# EAGLE design GammaSpectrometer (EAGLE 6.3)
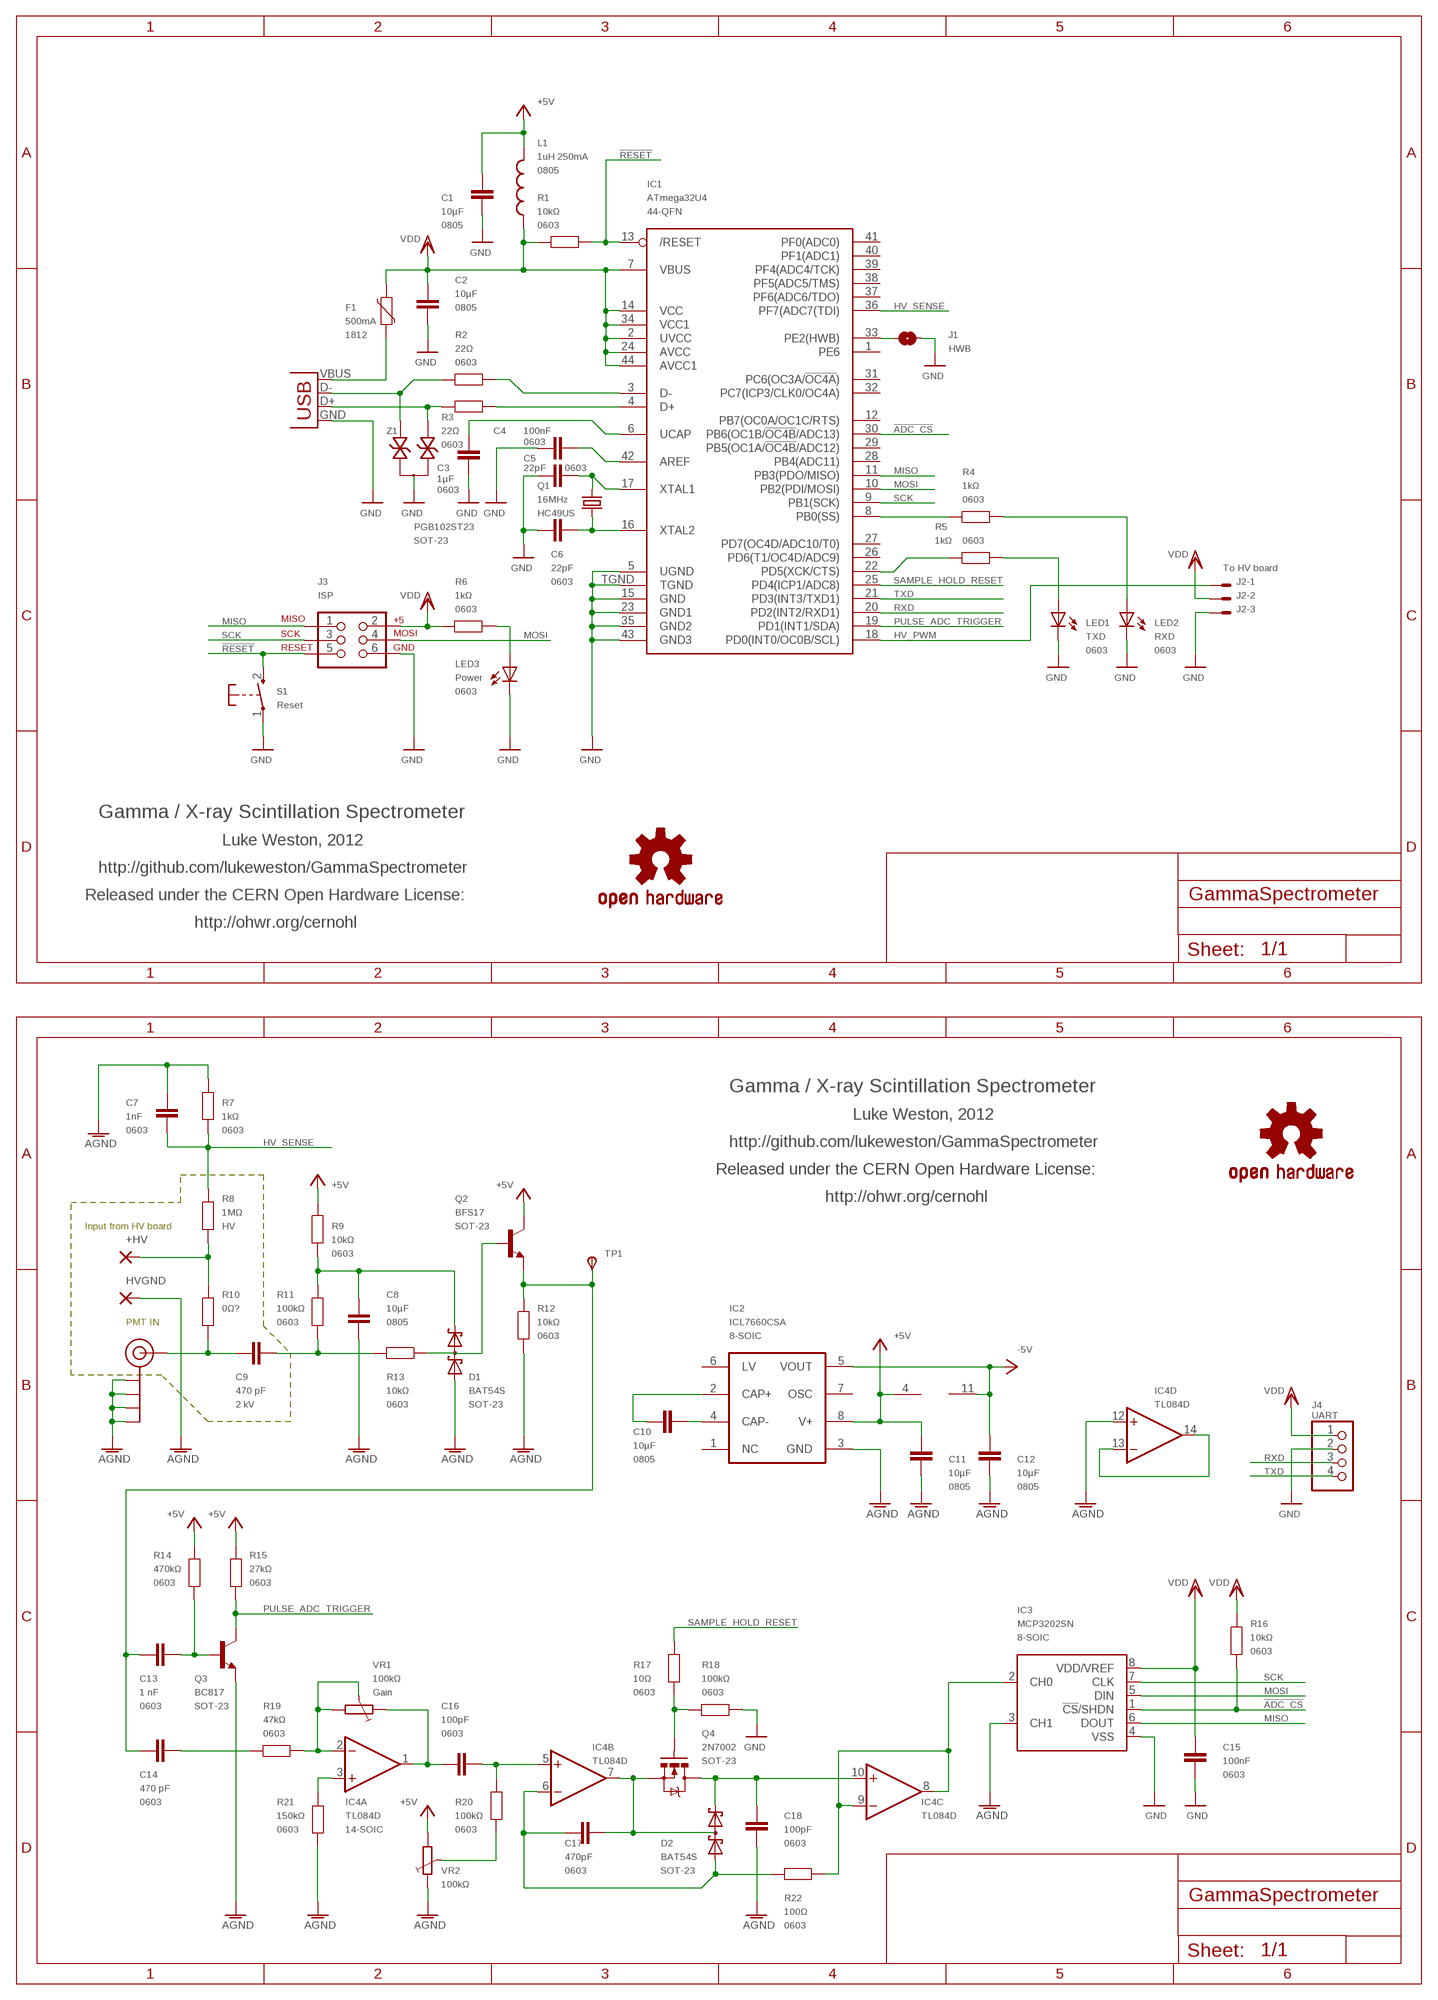
[diagram p0: schematic, sheet 1]

## Parts
C1  10µF  CAP0805  [0805]
C2  10µF  CAP0805  [0805]
C3  1µF  CAP0603  [0603]
C4  100nF  CAP0603  [0603]
C5  22pF  CAP0603  [0603]
C6  22pF  CAP0603  [0603]
C7  1nF  CAP0603  [0603]
C8  10µF  CAP0805  [0805]
C9  470 pF  CAP0603  [0603]
C10  10µF  CAP0805  [0805]
C11  10µF  CAP0805  [0805]
C12  10µF  CAP0805  [0805]
C13  1 nF  CAP0603  [0603]
C14  470 pF  CAP0603  [0603]
C15  100nF  CAP0603  [0603]
C16  100pF  CAP0603  [0603]
C17  470pF  CAP0603  [0603]
C18  100pF  CAP0603  [0603]
D1  BAT54S  [SOT23]
D2  BAT54S  [SOT23]
F1  500mA  PTC  [1812]
IC1  ATmega32U4  ATMEGA32U4-QFN  [QFN-44N]
IC2  ICL7660CSA  [SO08]
IC3  MCP3202SN  [SO-08]
IC4  TL084D  [SO14]
J1  HWB  SJ  [SJ]
J2  To HV board  22-23-2031  [22-23-2031]
J3  ISP  AVR_SPI_PRG_6NS  [2X3-NS]
J4  UART  PINHD-1X4  [1X04]
J$1  PMT  SMA_EDGE  [SMA-EDGE]
L1  1uH 250mA  L-USL2012C  [L2012C]
LED1  TXD  LED0603  [LED-0603]
LED2  RXD  LED0603  [LED-0603]
LED3  Power  LED0603  [LED-0603]
PAD1  +HV  2,54/0,9  [2,54/0,9]
PAD2  HVGND  2,54/0,9  [2,54/0,9]
Q1  16MHz  CRYSTALHC49US  [HC49US]
Q2  BFS17  BFS17-NPN-SOT23-BEC  [SOT23-BEC]
Q3  BC817  BC817-NPN-SOT23-BEC  [SOT23-BEC]
Q4  2N7002  MOSFET-NCHANNELSMD  [SOT23-3]
R1  10kΩ  RESISTOR0603  [0603]
R2  22Ω  RESISTOR0603  [0603]
R3  22Ω  RESISTOR0603  [0603]
R4  1kΩ  RESISTOR0603  [0603]
R5  1kΩ  RESISTOR0603  [0603]
R6  1kΩ  RESISTOR0603  [0603]
R7  1kΩ  RESISTOR0603  [0603]
R8  1MΩ  RESISTOR0603  [0603]
R9  10kΩ  RESISTOR0603  [0603]
R10  0Ω?  RESISTOR0603  [0603]
R11  100kΩ  RESISTOR0603  [0603]
R12  10kΩ  RESISTOR0603  [0603]
R13  10kΩ  RESISTOR0603  [0603]
R14  470kΩ  RESISTOR0603  [0603]
R15  27kΩ  RESISTOR0603  [0603]
R16  10kΩ  RESISTOR0603  [0603]
R17  10Ω  RESISTOR0603  [0603]
R18  100kΩ  RESISTOR0603  [0603]
R19  47kΩ  RESISTOR0603  [0603]
R20  100kΩ  RESISTOR0603  [0603]
R21  150kΩ  RESISTOR0603  [0603]
R22  100Ω  RESISTOR0603  [0603]
S1  Reset  TAC_SWITCH_2PIN  [TACTILE_SWITCH_SMD_2PIN_TINY]
SY  OSHW-LOGOS  [OSHW-LOGO-S]
SY1  OSHW-LOGOS  [OSHW-LOGO-S]
TP1  TPSPAD1-13  [P1-13]
VR1  100kΩ  TRIM_EU-CT6  [CT6]
VR2  100kΩ  TRIM_EU-CT6  [CT6]
X1  USB-MICROB  [USB-MICROB]
Z1  PGB102ST23  [SOT23-3]

## Nets
!ADC_CS: IC1.30(PB6(OC1B/!OC4B!/ADC13)) IC3.1(!CS!/SHDN) R16.1
!RESET: IC1.13(/RESET) J3.5 R1.1 S1.2(S)
+5V: C1.1 C11.1 IC2.8(V+) IC4.4(P:V+) L1.2 Q2.C R9.2 R14.1 R15.1 VR2.A
-5V: C12.1 IC2.5(VOUT) IC4.11(P:V-)
AGND: C7.2 C8.2 C11.2 C12.2 C18.2 D1.1(A1) IC2.3(GND) IC3.3(CH1) IC4.12(D:+IN) J$1.GND@0(GND) J$1.GND@1(GND) J$1.GND@2(GND) J$1.GND@3(GND) PAD2.1(P) Q3.E R7.2 R12.1 R21.2 VR2.E
GND: C1.2 C2.2 C3.1 C4.1 C5.1 C6.1 C15.1 IC1.5(UGND) IC1.15(GND) IC1.23(GND1) IC1.35(GND2) IC1.43(GND3) IC1.TGND IC3.4(VSS) J1.1 J2.3 J3.6 J4.2 LED1.C LED2.C LED3.C R18.2 S1.1(P) X1.GND Z1.3
HV_PWM: IC1.18(PD0(INT0/OC0B/SCL)) J2.1
HV_SENSE: C7.1 IC1.36(PF7(ADC7(TDI)) R7.1 R8.2
HWB: IC1.33(PE2(HWB)) J1.2
MISO: IC1.11(PB3(PDO/MISO)) IC3.6(DOUT) J3.1
MOSI: IC1.10(PB2(PDI/MOSI)) IC3.5(DIN) J3.4
N$1: PAD1.1(P) R8.1 R10.2
N$2: C9.1 J$1.SIG(SIGNAL) R10.1
N$3: C8.1 D1.3(C2) R9.1 R11.2
N$4: C9.2 R11.1 R13.2
N$5: C18.1 D2.3(C2) IC4.10(C:+IN) Q4.3(D)
N$6: IC4.2(A:-IN) R19.2 VR1.A VR1.S
N$7: C13.2 C14.2 Q2.E R12.2 TP1.TP(PP)
N$8: C14.1 R19.1
N$9: C17.1 D2.2(C1A2) IC4.7(B:OUT) Q4.2(S)
N$10: IC4.3(A:+IN) R21.1
N$11: C16.2 IC4.1(A:OUT) VR1.E
N$12: D1.2(C1A2) Q2.B R13.1
N$13: C13.1 Q3.B R14.2
N$14: R20.2 VR2.S
N$15: C16.1 IC4.5(B:+IN) R20.1
N$16: C17.2 D2.1(A1) IC4.6(B:-IN) R22.2
N$17: C10.2 IC2.2(CAP+)
N$18: C10.1 IC2.4(CAP-)
N$19: Q4.1(G) R17.1 R18.1
N$20: F1.1 X1.VBUS
N$21: LED3.A R6.2
N$22: C4.2 IC1.42(AREF)
N$23: LED1.A R5.2
N$24: LED2.A R4.2
N$26: IC4.13(D:-IN) IC4.14(D:OUT)
N$28: C3.2 IC1.6(UCAP)
N$33: R3.2 X1.D+ Z1.1
N$34: R2.2 X1.D- Z1.2
N$35: C5.2 IC1.17(XTAL1) Q1.2
N$36: C6.2 IC1.16(XTAL2) Q1.1
N$37: IC1.4(D+) R3.1
N$38: IC1.3(D-) R2.1
PULSE: IC3.2(CH0) IC4.8(C:OUT) IC4.9(C:-IN) R22.1
PULSE_ADC_TRIGGER: IC1.19(PD1(INT1/SDA)) Q3.C R15.2
RXD: IC1.20(PD2(INT2/RXD1)) J4.3
RXLED: IC1.8(PB0(SS)) R4.1
SAMPLE_HOLD_RESET: IC1.25(PD4(ICP1/ADC8)) R17.2
SCK: IC1.9(PB1(SCK)) IC3.7(CLK) J3.3
TXD: IC1.21(PD3(INT3/TXD1)) J4.4
TXLED: IC1.22(PD5(XCK/CTS)) R5.1
VDD: C2.1 C15.2 F1.2 IC1.2(UVCC) IC1.7(VBUS) IC1.14(VCC) IC1.24(AVCC) IC1.34(VCC1) IC1.44(AVCC1) IC3.8(VDD/VREF) J2.2 J3.2 J4.1 L1.1 R1.2 R6.1 R16.2
Unconnected: IC1.1(PE6) IC1.12(PB7(OC0A/OC1C/RTS)) IC1.26(PD6(T1/OC4D/ADC9)) IC1.27(PD7(OC4D/ADC10/T0)) IC1.28(PB4(ADC11)) IC1.29(PB5(OC1A/!OC4B!/ADC12)) IC1.31(PC6(OC3A/!OC4A!)) IC1.32(PC7(ICP3/CLK0/OC4A)) IC1.37(PF6(ADC6/TDO)) IC1.38(PF5(ADC5/TMS)) IC1.39(PF4(ADC4/TCK)) IC1.40(PF1(ADC1)) IC1.41(PF0(ADC0)) IC2.1(NC) IC2.6(LV) IC2.7(OSC)

## Notes on the sheet
- Gamma / X-ray Scintillation Spectrometer
- Luke Weston, 2012
- http://github.com/lukeweston/GammaSpectrometer
- Released under the CERN Open Hardware License:
- http://ohwr.org/cernohl
- Gamma / X-ray Scintillation Spectrometer
- Luke Weston, 2012
- http://github.com/lukeweston/GammaSpectrometer
- Released under the CERN Open Hardware License:
- http://ohwr.org/cernohl
- Input from HV board
- PMT IN

## Library data of the parts
C1 C2 C8 C10-C12 = freetronics-master-v1:CAP: Capacitor Standard 0603 ceramic capacitor, and 0.1" leaded capacitor.; PACKAGE: 0805
C3-C7 C13-C18 = freetronics-master-v1:CAP: Capacitor Standard 0603 ceramic capacitor, and 0.1" leaded capacitor.; PACKAGE: 0603
C9 = freetronics-master-v1:CAP: Capacitor Standard 0603 ceramic capacitor, and 0.1" leaded capacitor.; VOLTAGE: 2 kV
D1 D2 = diode:BAT54S: Schottky Diodes Source: Fairchild .. BAT54.pdf; PACKAGE: SOT-23
F1 = freetronics-luke:PTC: Polymeric PTC ("Polyfuse"); PACKAGE: 1812
IC1 = freetronics-jon:ATMEGA32U4: ATMEGA32U4; PACKAGE: 44-QFN
IC2 = maxim:ICL7660CSA: VOLTAGE CONVERTER; MF: MAXIM; MPN: ICL7660CSA; OC_FARNELL: 9724710; OC_NEWARK: 34C3732; PACKAGE: 8-SOIC
IC3 = microchip-6:MCP3202: 2.7V Dual Channel 12-Bit A/D Converter with SPI Serial Interface Source: http://ww1.microchip.com/downloads/en/DeviceDoc/21034D.pdf; PACKAGE: 8-SOIC
IC4 = linear:TL084: OP AMP; PACKAGE: 14-SOIC
J1 = freetronics-luke:SJ: PCB "solder jumper". Note that there should nothing on the BOM corresponding to this "component".
J2 = con-molex:22-23-2031: .100" (2.54mm) Center Header - 3 Pin; MF: MOLEX; MPN: 22-23-2031; OC_FARNELL: 1462950; OC_NEWARK: 30C0862
J3 = SparkFun:AVR_SPI_PRG_6: AVR ISP 6 Pin This is the reduced ISP connector for AVR programming. Common on Arduino. This footprint will take up less PCB space and can be used with a 10-pin to 6-pin adapter such as SKU: BOB-08508
J4 = pinhead:PINHD-1X4: PIN HEADER
J$1 = SparkFun-Connectors:SMA_EDGE: SMA Antenna Connector End launch SMA connector. The paste layer has been removed so that the connector can be hand soldered onto the board after reflow.
L1 = rcl:L-US: INDUCTOR, American symbol; PACKAGE: 0805
LED1-LED3 = freetronics-master-v1:LED: LEDs Standard schematic elements and footprints for 5mm, 3mm, 1206, and 0603 sized LEDs. 5mm - Spark Fun Electronics SKU : COM-00529 (and others); PACKAGE: 0603
PAD1 PAD2 = wirepad:2,54/0,9: THROUGH-HOLE PAD
Q1 = freetronics-master-v1:CRYSTAL: Crystals Various standard crystals. Proven footprints. Spark Fun Electronics SKU : COM-00534; PACKAGE: HC49US
Q2 Q3 = transistor:*-NPN-: NPN Transistror BF959 corrected 2008.03.06; PACKAGE: SOT-23
Q4 = freetronics-master-v1:MOSFET-NCHANNEL; PACKAGE: SOT-23
R1-R7 R9 R11-R22 = freetronics-master-v1:RESISTOR: Resistor Basic schematic elements and footprints for 0603, 1206, and PTH 1/10th watt (small) resistors.; PACKAGE: 0603
R8 = freetronics-master-v1:RESISTOR: Resistor Basic schematic elements and footprints for 0603, 1206, and PTH 1/10th watt (small) resistors.; VOLTAGE: HV
R10 = freetronics-master-v1:RESISTOR: Resistor Basic schematic elements and footprints for 0603, 1206, and PTH 1/10th watt (small) resistors.
S1 = freetronics-master-v1:TAC_SWITCH_2PIN: Momentary Tactile Switch - 2 pin
SY SY1 = SparkFun:OSHW-LOGO: Open Source Hardware Logo This logo indicates the piece of hardware it is found on incorporates a OSHW license and/or adheres to the definition of open source hardware found here: http://freedomdefined.org/OSHW
TP1 = testpad:TPS: TEST PIN
VR1 = pot:TRIM_EU-: POTENTIOMETER; FUNCTION: Gain
VR2 = pot:TRIM_EU-: POTENTIOMETER
X1 = freetronics-master-v1:USB: USB Connectors USB-B-PTH is fully proven SKU : PRT-00139 USB-miniB is fully proven SKU : PRT-00587 USB-A-PCB is untested. USB-A-H is throughly reviewed, but untested. Spark Fun Electronics SKU : PRT-00437 USB-B-SMT is throughly reviewed, but untested. Needs silkscreen touching up. USB-A-S has not been used/tested USB-MB-H has not been used/tested
Z1 = freetronics-luke:PGB102ST23: Littelfuse PGB1 ESD transient suppressor in dual SOT-23 package. http://www.littelfuse.com/data/en/Data_Sheets/Littelfuse_PulseGuard-ESD_PGB1.pdf; PACKAGE: SOT-23

## Board
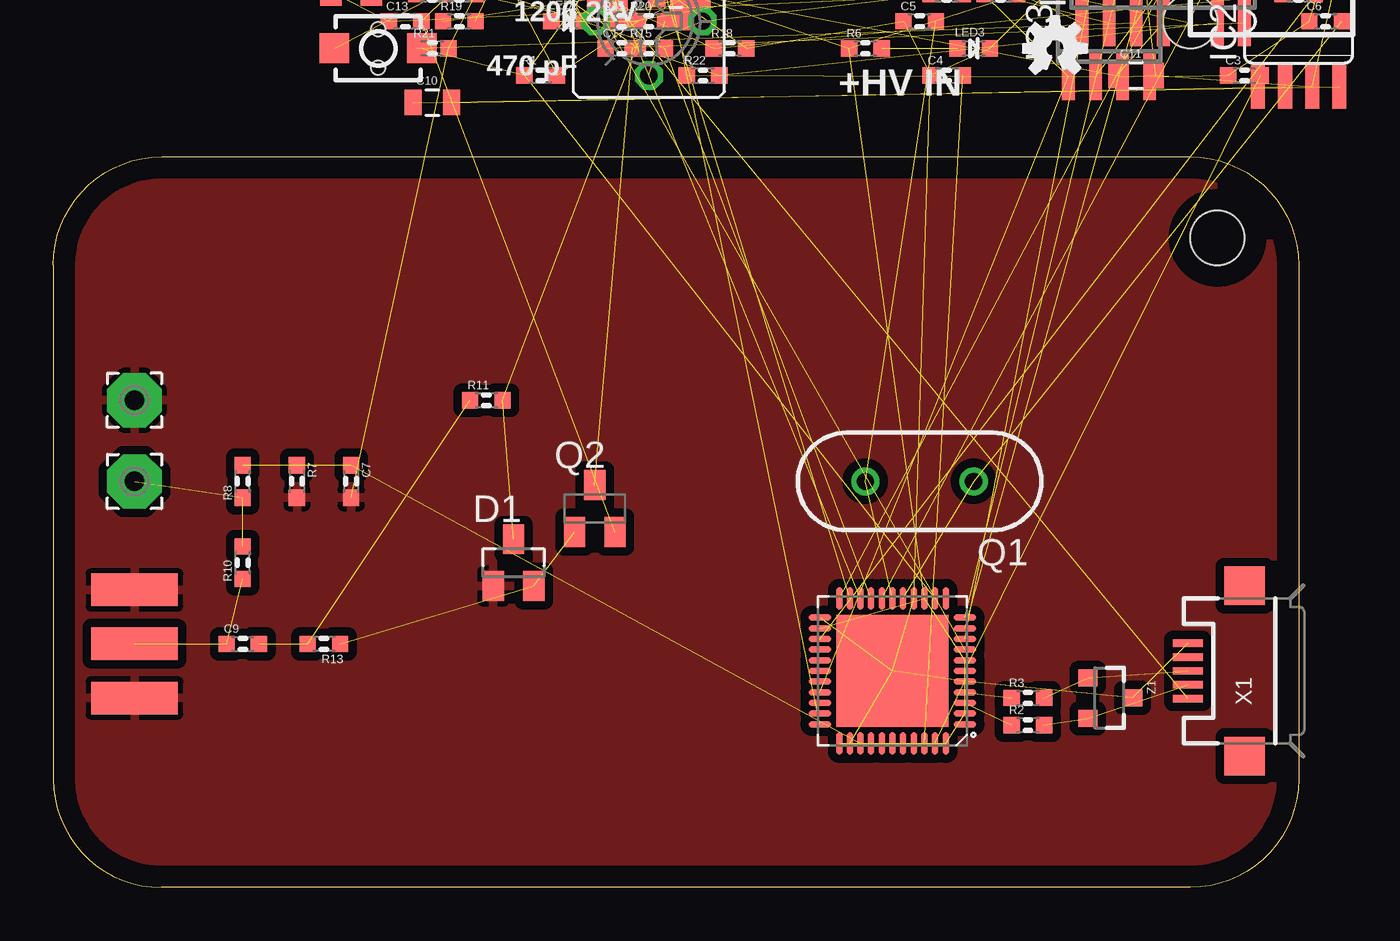
[diagram p1: board, top side]
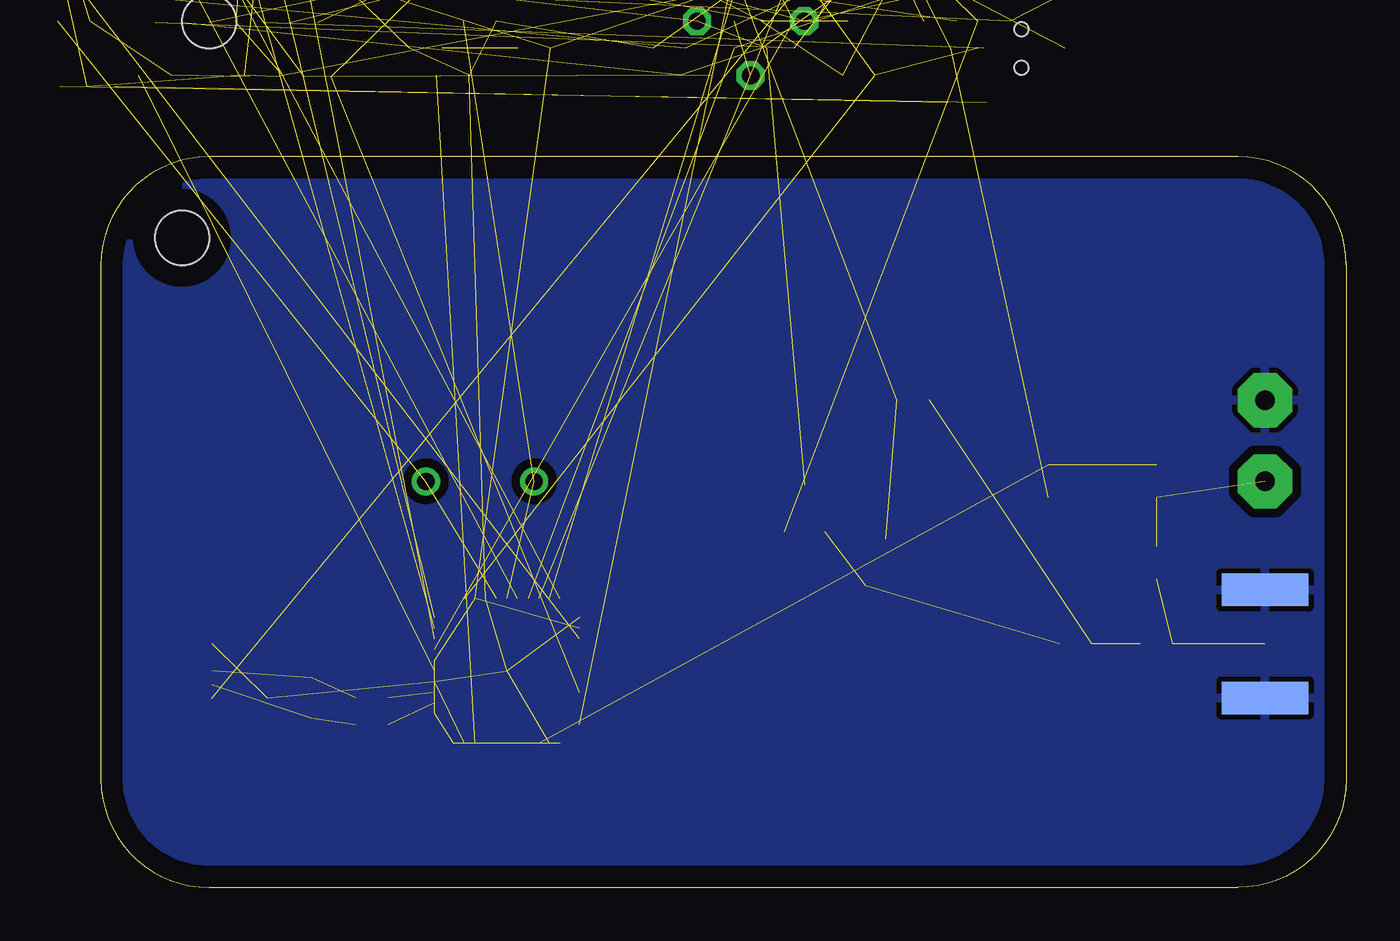
[diagram p2: board, bottom side, seen from below]

Size 58.42 x 34.29 mm. Coordinates in mm from the lower left corner, seen from the top.
Outline: 0,29.21 0,5.08 arc90 5.08,0 53.34,0 arc90 58.42,5.08 58.42,29.21 arc90 53.34,34.29 5.08,34.29 arc90 0,29.21
Copper layers (1*16): Top 0.035mm / dielectric 1.5mm / Bottom 0.035mm
Design rules "default": minimum track width 10mil, minimum drill 24mil, track to track 8mil, track to pad 8mil, pad to pad 8mil, via to via 8mil, smd to smd 8mil, copper to edge 40mil, drill to drill 8mil, minimum pad ring 10mil, minimum via ring 8mil, stop-mask expansion 4mil, vias tented up to drill 0mil, thermal gap 10mil
Holes 2.54 mm at 53.34,40.64 54.61,30.48

### Footprints (pad centres in the part's own frame; a part is rotated, then mirrored left to right if it is on the bottom)
0805 = smd 0.8 x 1.2: 1 -0.9,0; 2 0.9,0
0603 = smd 0.762 x 0.762: 1 -0.762,0; 2 0.762,0
SOT23 = smd 1 x 1.4: 1 -0.95,-1.1; 2 0.95,-1.1; 3 0,1.1
1812 = smd 1.9 x 3.4: 1 -1.95,0; 2 1.95,0
QFN-44N = smd 0.3 x 1.05: 1 -2.5,-3.4; 2 -2,-3.4; 3 -1.5,-3.4; 4 -1,-3.4; 5 -0.5,-3.4; 6 0,-3.4; 7 0.5,-3.4; 8 1,-3.4; 9 1.5,-3.4; 10 2,-3.4; 11 2.5,-3.4; 23 2.5,3.4; 24 2,3.4; 25 1.5,3.4; 26 1,3.4; 27 0.5,3.4; 28 0,3.4; 29 -0.5,3.4; 30 -1,3.4; 31 -1.5,3.4; 32 -2,3.4; 33 -2.5,3.4 | smd 1.05 x 0.3: 12 3.4,-2.5; 13 3.4,-2; 14 3.4,-1.5; 15 3.4,-1; 16 3.4,-0.5; 17 3.4,0; 18 3.4,0.5; 19 3.4,1; 20 3.4,1.5; 21 3.4,2; 22 3.4,2.5; 34 -3.4,2.5; 35 -3.4,2; 36 -3.4,1.5; 37 -3.4,1; 38 -3.4,0.5; 39 -3.4,0; 40 -3.4,-0.5; 41 -3.4,-1; 42 -3.4,-1.5; 43 -3.4,-2; 44 -3.4,-2.5 | smd 5.25 x 5.25: TGND 0,0
SO08 = smd 0.66 x 2.032: 1 -1.905,-3.073; 2 -0.635,-3.073; 3 0.635,-3.073; 4 1.905,-3.073; 5 1.905,3.073; 6 0.635,3.073; 7 -0.635,3.073; 8 -1.905,3.073
SO-08 = smd 0.6 x 2.2: 1 -1.905,-2.6; 2 -0.635,-2.6; 3 0.635,-2.6; 4 1.905,-2.6; 5 1.905,2.6; 6 0.635,2.6; 7 -0.635,2.6; 8 -1.905,2.6
SO14 = smd 0.6 x 2.2: 1 -3.81,-2.6; 2 -2.54,-2.6; 3 -1.27,-2.6; 4 0,-2.6; 5 1.27,-2.6; 6 2.54,-2.6; 7 3.81,-2.6; 8 3.81,2.6; 9 2.54,2.6; 10 1.27,2.6; 11 0,2.6; 12 -1.27,2.6; 13 -2.54,2.6; 14 -3.81,2.6
SJ = smd 1.168 x 1.6: 1 -0.762,0; 2 0.762,0
22-23-2031 = drill 1 long: 1 -2.54,0; 2 0,0; 3 2.54,0
2X3-NS = drill 1.016 pad 1.88 square: 1 -2.54,-1.27 | drill 1.016 pad 1.88 octagon: 2 -2.54,1.27; 3 0,-1.27; 4 0,1.27; 5 2.54,-1.27; 6 2.54,1.27
1X04 = drill 0.9 pad 1.93: 1 -3.81,0; 2 -1.27,0; 3 1.27,0; 4 3.81,0
SMA-EDGE = smd 1.524 x 4.064: GND@0 0,0; GND@1 5.08,0; SIG 2.54,0 | smd 1.524 x 4.064 bottom: GND@2 0,0; GND@3 5.08,0
L2012C = smd 1 x 1: 1 -1,0; 2 1,0
LED-0603 = smd 0.762 x 0.762: A -0.762,0; C 0.762,0
2,54/0,9 = drill 0.914 pad 2.54 octagon: 1 0,0
HC49US = drill 0.813: 1 -2.54,0; 2 2.54,0
SOT23-BEC = smd 1 x 1.4: B -0.95,-1.1; C 0,1.1; E 0.95,-1.1
SOT23-3 = smd 0.8 x 0.9: 1 -0.95,-1; 2 0.95,-1; 3 0,1.1
TACTILE_SWITCH_SMD_2PIN_TINY = smd 1.4 x 1.4: 1 -2.05,0; 2 2.05,0 | hole 0.65: 0,0.9; 0,-0.9
P1-13 = drill 1.321 pad 2.159 octagon: TP 0,0
CT6 = drill 0.813 octagon: A 2.515,0; E -2.515,0; S 0,-2.54
USB-MICROB = smd 0.35 x 1.4: D+ 0,2.65; D- -0.65,2.65; GND 1.3,2.65; ID 0.65,2.65; VBUS -1.3,2.65 | smd 1.8 x 1.9: MT1 -4,0; MT2 4,0

### Placement (x,y rotation side)
C1  55.88,44.45 0 top  (outside the outline)
C2  48.26,44.45 0 top  (outside the outline)
C3  55.88,38.1 0 top  (outside the outline)
C4  41.91,38.1 0 top  (outside the outline)
C5  40.64,40.64 0 top  (outside the outline)
C6  59.69,40.64 0 top  (outside the outline)
C7  13.97,19.05 270 top
C8  29.21,41.91 0 top  (outside the outline)
C9  8.89,11.43 0 top
C10  17.78,36.83 0 top
C11  50.8,38.1 0 top  (outside the outline)
C12  59.69,44.45 0 top  (outside the outline)
C13  16.51,40.64 0 top  (outside the outline)
C14  35.56,43.18 0 top  (outside the outline)
C15  26.67,40.64 0 top  (outside the outline)
C16  41.91,43.18 0 top  (outside the outline)
C17  26.67,39.37 0 top  (outside the outline)
C18  19.05,41.91 0 top  (outside the outline)
D1  21.59,15.24 0 top
D2  20.95,45.72 0 top  (outside the outline)
F1  27.94,41.91 0 top  (outside the outline)
IC1  39.37,10.16 90 top
IC2  58.42,40.64 0 top  (outside the outline)
IC3  49.53,40.64 0 top  (outside the outline)
IC4  52.07,43.18 0 top  (outside the outline)
J1  27.94,43.18 0 top  (outside the outline)
J2  57.15,43.18 0 top  (outside the outline)
J3  24.13,45.72 0 top  (outside the outline)
J4  24.13,44.45 0 top  (outside the outline)
J$1  3.81,8.89 90 top
L1  50.8,44.45 0 top  (outside the outline)
LED1  53.34,45.72 0 top  (outside the outline)
LED2  24.13,40.64 0 top  (outside the outline)
LED3  43.18,39.37 0 top  (outside the outline)
PAD1  3.81,19.05 0 top
PAD2  3.81,22.86 0 top
Q1  40.64,19.05 180 top
Q2  25.4,17.78 0 top
Q3  13.97,43.18 0 top  (outside the outline)
Q4  16.19,45.72 270 top  (outside the outline)
R1  22.86,38.1 0 top  (outside the outline)
R2  45.72,7.62 0 top
R3  45.72,8.89 0 top
R4  26.67,40.64 0 top  (outside the outline)
R5  53.34,43.18 0 top  (outside the outline)
R6  38.1,39.37 0 top  (outside the outline)
R7  11.43,19.05 270 top
R8  8.89,19.05 90 top
R9  46.99,44.45 0 top  (outside the outline)
R10  8.89,15.24 90 top
R11  20.32,22.86 0 top
R12  17.78,41.91 0 top  (outside the outline)
R13  12.7,11.43 180 top
R14  41.91,41.91 0 top  (outside the outline)
R15  27.94,39.37 0 top  (outside the outline)
R16  44.45,41.91 0 top  (outside the outline)
R17  58.42,41.91 0 top  (outside the outline)
R18  31.75,39.37 0 top  (outside the outline)
R19  19.05,40.64 0 top  (outside the outline)
R20  27.94,40.64 0 top  (outside the outline)
R21  17.78,39.37 0 top  (outside the outline)
R22  30.48,38.1 0 top  (outside the outline)
S1  15.24,39.37 0 top  (outside the outline)
SY  46.99,39.37 0 top  (outside the outline)
SY1  27.94,45.72 0 top  (outside the outline)
TP1  24.13,45.72 0 top  (outside the outline)
VR1  21.59,46.99 0 top  (outside the outline)
VR2  27.94,40.64 0 top  (outside the outline)
X1  55.88,10.16 90 top
Z1  49.53,8.89 270 top

### Tracks (layer width: path | path; a pad name or v marks a point on that pad's centre or on a via)
!ADC_CS  (2 unrouted)
!RESET  (3 unrouted)
+5V  (9 unrouted)
-5V  (2 unrouted)
AGND  (11 unrouted)
  pour Top (isolate 0.406): -1.27,35.56 59.69,35.56 59.69,-1.27 -1.27,-1.27
  pour Bottom (isolate 0.406): -1.27,35.56 59.69,35.56 59.69,-1.27 -1.27,-1.27
GND  (24 unrouted)
HV_PWM  (1 unrouted)
HV_SENSE  (3 unrouted)
HWB  (1 unrouted)
MISO  (2 unrouted)
MOSI  (2 unrouted)
N$1  (2 unrouted)
N$2  (2 unrouted)
N$3  (3 unrouted)
N$4  (2 unrouted)
N$5  (3 unrouted)
N$6  (3 unrouted)
N$7  (4 unrouted)
N$8  (1 unrouted)
N$9  (3 unrouted)
N$10  (1 unrouted)
N$11  (2 unrouted)
N$12  (2 unrouted)
N$13  (2 unrouted)
N$14  (1 unrouted)
N$15  (2 unrouted)
N$16  (3 unrouted)
N$17  (1 unrouted)
N$18  (1 unrouted)
N$19  (2 unrouted)
N$20  (1 unrouted)
N$21  (1 unrouted)
N$22  (1 unrouted)
N$23  (1 unrouted)
N$24  (1 unrouted)
N$26  (1 unrouted)
N$28  (1 unrouted)
N$33  (2 unrouted)
N$34  (2 unrouted)
N$35  (2 unrouted)
N$36  (2 unrouted)
N$37  (1 unrouted)
N$38  (1 unrouted)
PULSE  (3 unrouted)
PULSE_ADC_TRIGGER  (2 unrouted)
RXD  (1 unrouted)
RXLED  (1 unrouted)
SAMPLE_HOLD_RESET  (1 unrouted)
SCK  (2 unrouted)
TXD  (1 unrouted)
TXLED  (1 unrouted)
VDD  (16 unrouted)

### Text on the board
tPlace: HV GND | 1206 2kV | 470 pF | +HV IN